# Altium schematic sheet 10_IMU_BREAKOUT.SchDoc
size A
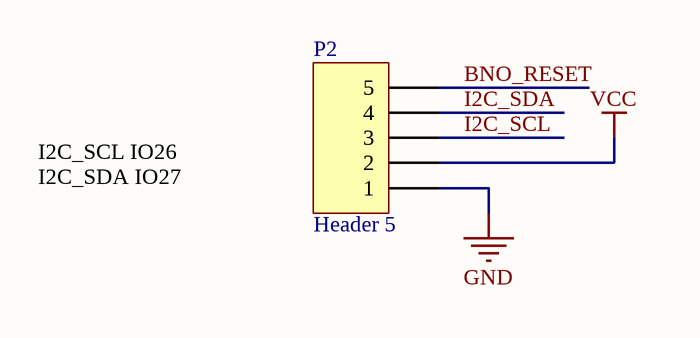
[diagram p0: 10_IMU_BREAKOUT.SchDoc]

## Parts
P2  Header 5  [HDR1X5]

## Nets
GND: P2.1
VCC: P2.2
BNO_RESET: P2.5
I2C_SCL: P2.3
I2C_SDA: P2.4

## Notes on the sheet
- I2C_SCL IO26
  I2C_SDA IO27

## Library data of the parts
P2 = Header 5: Header, 5-Pin; LatestRevisionDate: 17-Jul-2002; LatestRevisionNote: Re-released for DXP Platform.; Publisher: Altium Limited